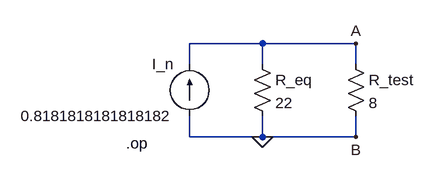
[diagram p0: schematic norton.asc]
norton.asc, the LTspice schematic file:
Version 4
SHEET 1 880 680
WIRE 176 112 64 112
WIRE 320 112 176 112
WIRE 64 144 64 112
WIRE 176 144 176 112
WIRE 320 144 320 112
WIRE 64 256 64 224
WIRE 176 256 176 224
WIRE 176 256 64 256
WIRE 320 256 320 224
WIRE 320 256 176 256
FLAG 176 256 0
FLAG 320 112 A
FLAG 320 256 B
SYMBOL current 64 224 R180
WINDOW 0 24 80 Left 2
WINDOW 3 24 0 Left 2
WINDOW 123 0 0 Left 0
WINDOW 39 0 0 Left 0
SYMATTR InstName I_n
SYMATTR Value 0.8181818181818182
SYMBOL res 160 128 R0
SYMATTR InstName R_eq
SYMATTR Value 22
SYMBOL res 304 128 R0
SYMATTR InstName R_test
SYMATTR Value 8
TEXT -34 266 Left 2 !.op

The netlist it stands for:
* norton.asc
I_n 0 A 0.8181818181818182
R_eq A 0 22
R_test A 0 8
.op
.backanno
.end

* Results of the author's LTspice run, read from the files saved beside the schematic
* Operating Point:
*   V(a) = 4.8 V
*   I(I_n) = 818.2 mA
*   I(R_test) = 600 mA
*   I(R_eq) = 218.2 mA